# Altium schematic sheet GPIO.SchDoc: Air724UG 参考设计
size 594 x 419 mm; DESIGNER: Loukanghua; REV: V1.0
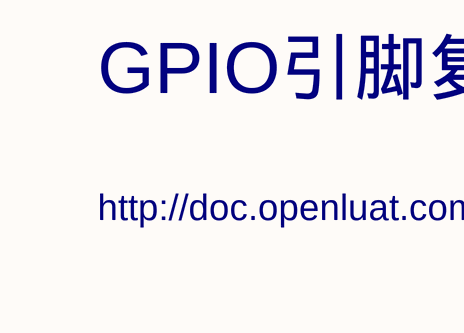
[diagram p0: GPIO.SchDoc, top left]
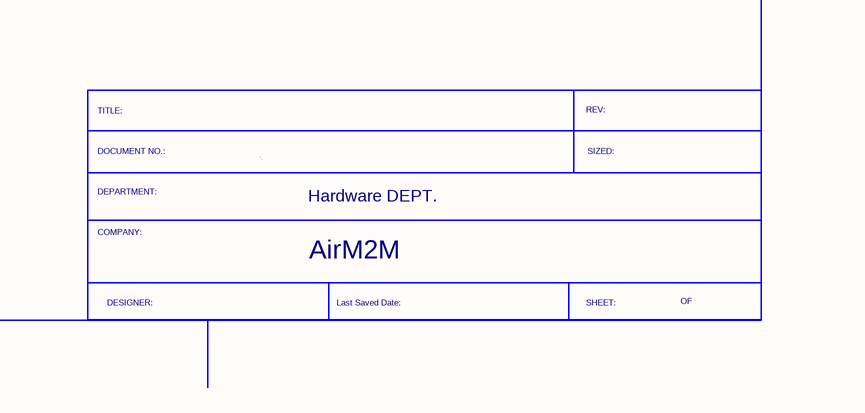
[diagram p1: GPIO.SchDoc, bottom right]

## Notes on the sheet
- GPIO引脚复用功能表
- http://doc.openluat.com/wiki/6?wiki_page_id=60
- TITLE:
- REV:
- DEPARTMENT:
- DOCUMENT NO.:
- Hardware DEPT.
- SIZED:
- COMPANY:
- AirM2M
- DESIGNER:
- Last Saved Date:
- SHEET:
- OF